# Altium schematic sheet Mini_Comm_sch.SchDoc
size A3
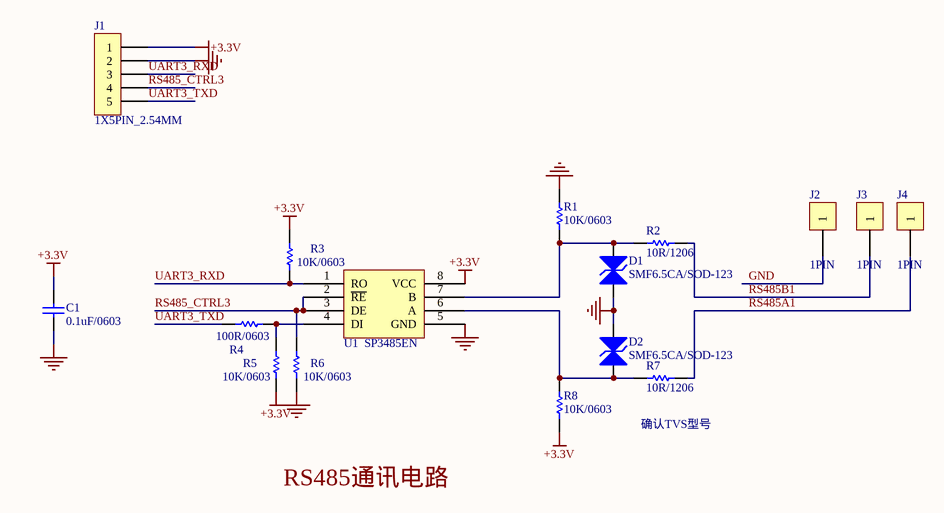
[diagram p0: Mini_Comm_sch.SchDoc]

## Parts
C1  0.1uF/0603  [CAP/SMT/0603C]
D1  SMF6.5CA/SOD-123  [D/SMT/SOD123]
D2  SMF6.5CA/SOD-123  [D/SMT/SOD123]
J1  1X5PIN_2.54MM  [CON/DIP/1×5PIN/2.0MM]
J2  1PIN  [CON/DIP/1PIN]
J3  1PIN  [CON/DIP/1PIN]
J4  1PIN  [CON/DIP/1PIN]
R1  10K/0603  [0603R]
R2  10R/1206  [1206R]
R3  10K/0603  [0603R]
R4  100R/0603  [0603R]
R5  10K/0603  [0603R]
R6  10K/0603  [0603R]
R7  10R/1206  [1206R]
R8  10K/0603  [0603R]
U1  SP3485EN  [SOIC-8]

## Nets
+3.3V: C1.2 J1.1 R3.2 R5.1 R8.2 U1.8(VCC)
GND: C1.1 D1.2(K) D2.2(K) J1.2 J2.1 R1.1 R6.2 U1.5(GND)
RS485_CTRL3: J1.4 R6.1 U1.2(~{RE}) U1.3(DE)
RS485A1: J4.1 R7.2
RS485B1: J3.1 R2.2
UART3_RXD: J1.3 R3.1 U1.1(RO)
UART3_TXD: J1.5 R4.2
NetD1_1: D1.1(A) R1.2 R2.1 U1.7(B)
NetD2_1: D2.1(A) R7.1 R8.1 U1.6(A)
NetR4_1: R4.1 R5.2 U1.4(DI)

## Notes on the sheet
- 确认TVS型号
- Labels drawn without touching a wire or pin: RS485通讯电路

## Library data of the parts
C1 = CAP/CAP/SMT/0603C
D1 D2 = D/TVS/SMT/SMF13CA/SOD-123
J1 = CON/DIP/1X5PIN_2.54MM: Connector
J2-J4 = CON/DIP/1PIN: Connector
R1 R3-R6 R8 = RES/RES/SMT/0603
R2 R7 = RES/RES/SMT/1206
U1 = SP485EN: MAXIM: *; PackageReference: SOIC8